# Altium schematic sheet MCU.SchDoc
size A3
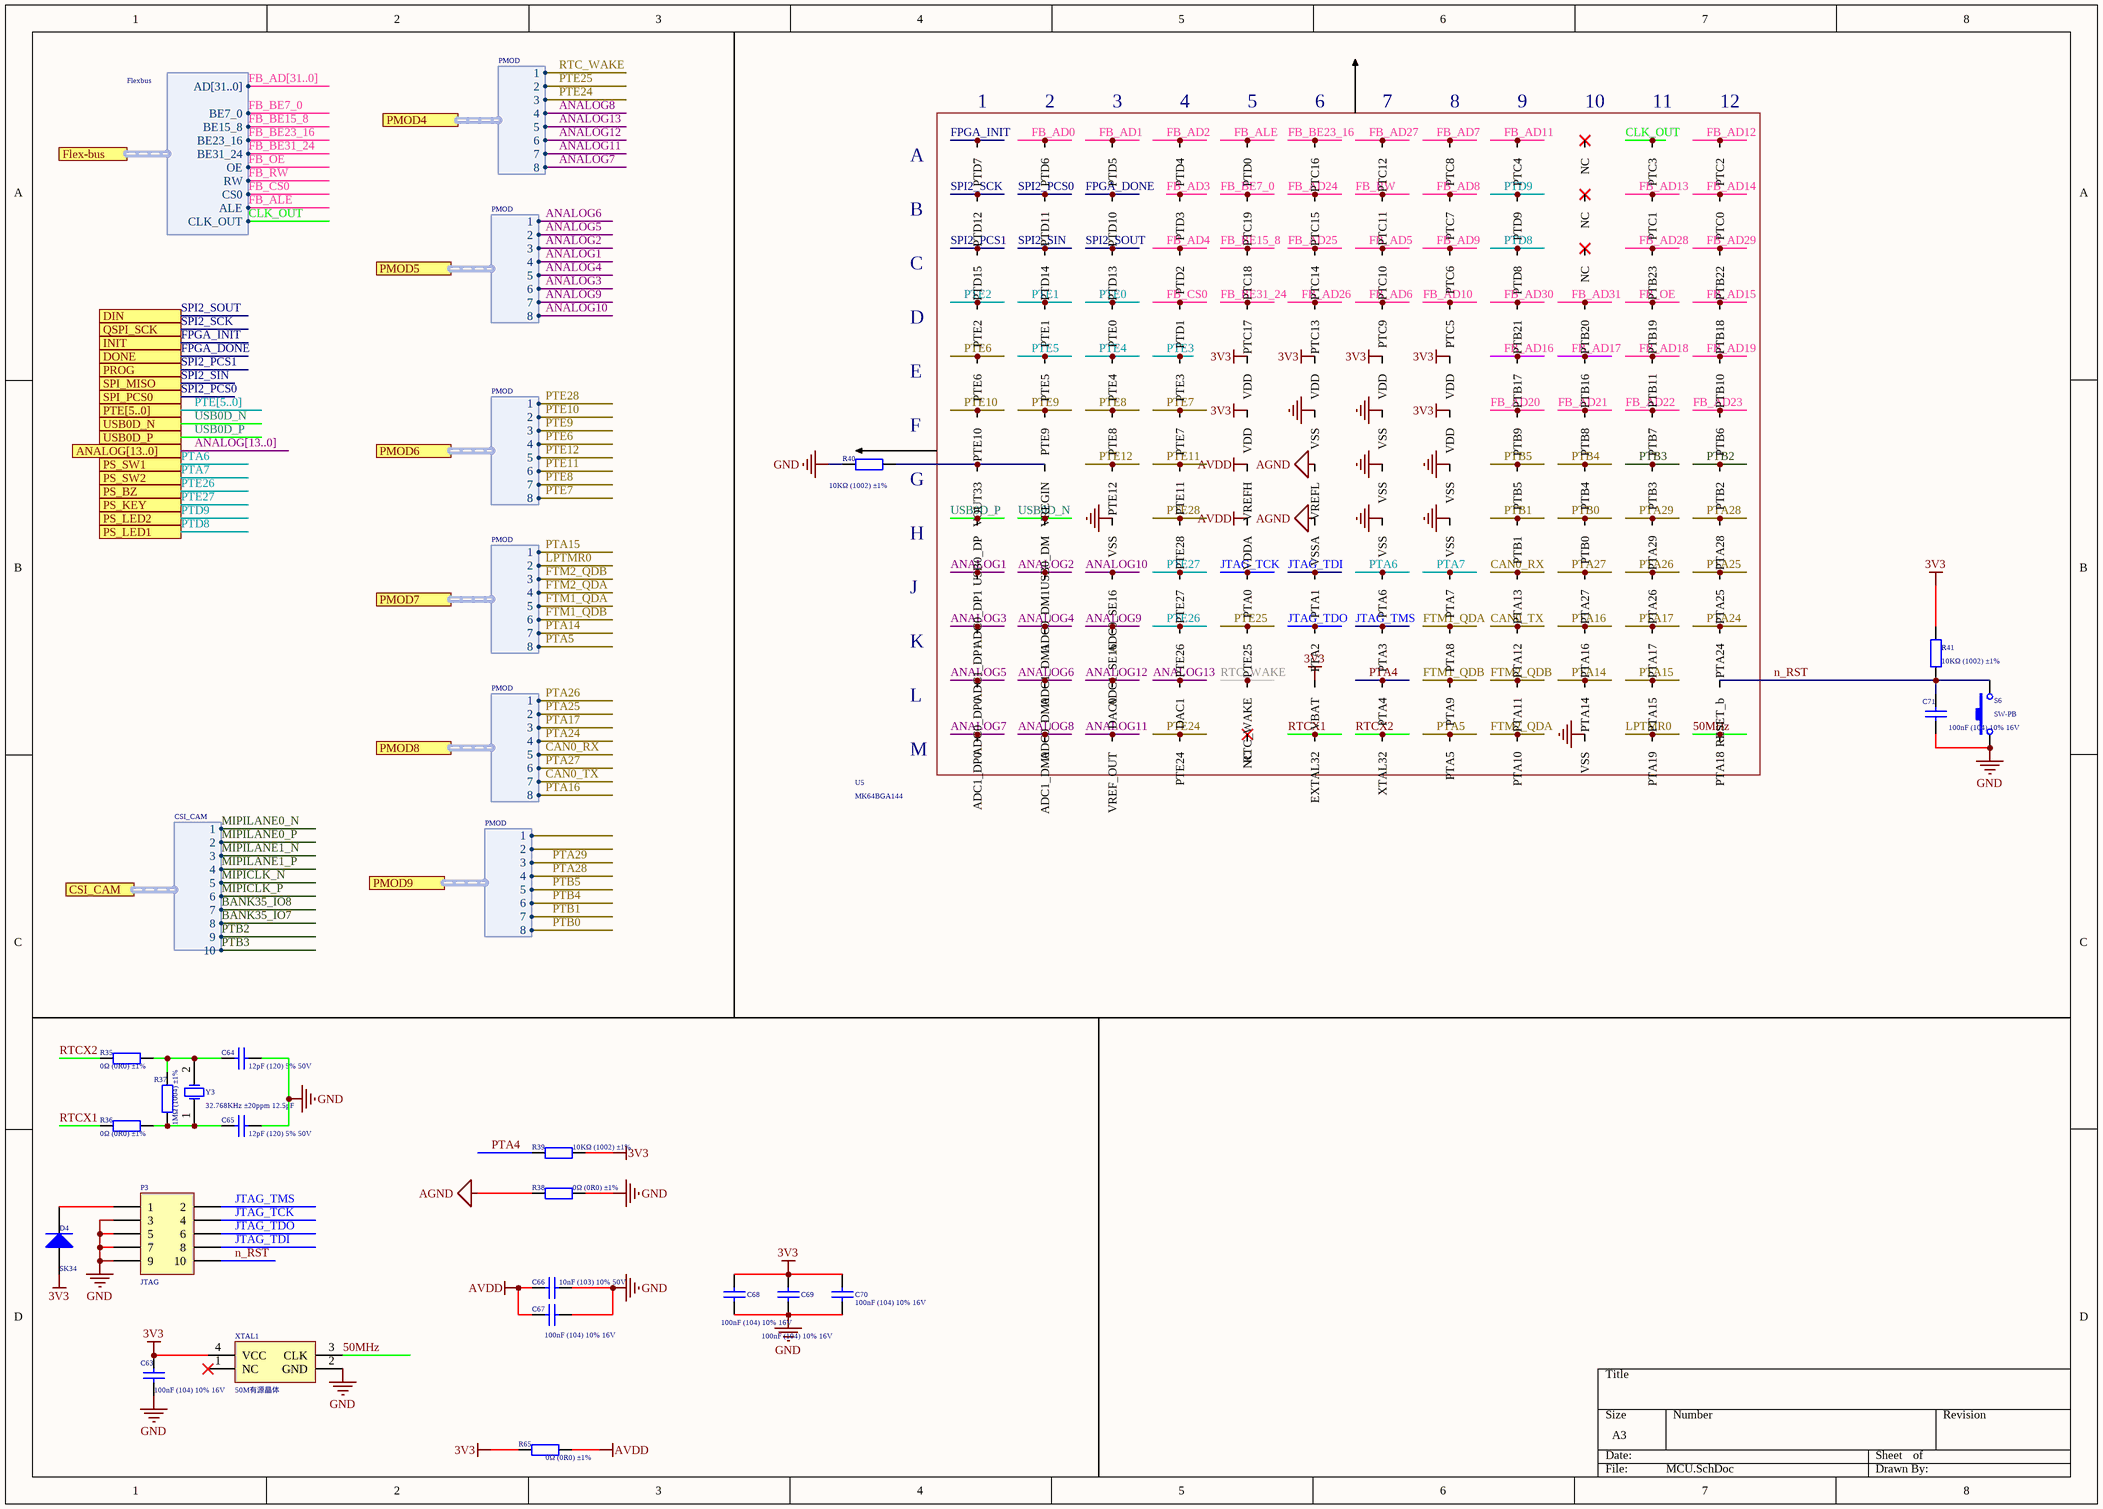
[diagram p0: MCU.SchDoc]

## Parts
C63  100nF (104) 10% 16V  [0402_C]
C64  12pF (120) 5% 50V  [0402_C]
C65  12pF (120) 5% 50V  [0402_C]
C66  10nF (103) 10% 50V  [0402_C]
C67  100nF (104) 10% 16V  [0402_C]
C68  100nF (104) 10% 16V  [0402_C]
C69  100nF (104) 10% 16V  [0402_C]
C70  100nF (104) 10% 16V  [0402_C]
C71  100nF (104) 10% 16V  [0402_C]
D4  SK34  [C2012]
P3  JTAG  [HDR2X5]
R35  0Ω (0R0) ±1%  [0402_R]
R36  0Ω (0R0) ±1%  [0402_R]
R37  1MΩ (1004) ±1%  [0402_R]
R38  0Ω (0R0) ±1%  [0402_R]
R39  10KΩ (1002) ±1%  [0402_R]
R40  10KΩ (1002) ±1%  [0402_R]
R41  10KΩ (1002) ±1%  [0402_R]
R65  0Ω (0R0) ±1%  [0402_R]
S6  SW-PB  [key 3*4*2]
U5  MK64BGA144  [BGA144C100P12X12_1300X1300X161]
XTAL1  50M有源晶体  [XTAL7_3225]
Y3  32.768KHz ±20ppm 12.5pF  [SMD-3215_2P FC - 135]

## Ports
ANALOG[13..0] (harness Flexbus), CSI_CAM (harness CSI_CAM), DIN, DONE, Flex-bus (harness Flexbus), INIT, PMOD4 (harness PMOD), PMOD5 (harness PMOD), PMOD6 (harness PMOD), PMOD7 (harness PMOD), PMOD8 (harness PMOD), PMOD9 (harness PMOD), PROG, PS_BZ, PS_KEY, PS_LED1, PS_LED2, PS_SW1, PS_SW2, PTE[5..0], QSPI_SCK, SPI_MISO, SPI_PCS0, USB0D_N, USB0D_P

## Harnesses
Flexbus: BE7_0, CS0, BE31_24, CLK_OUT, ALE, BE23_16, RW, BE15_8, OE, AD[31..0]
PMOD: 1, 2, 3, 4, 5, 6, 7, 8
CSI_CAM: 1, 2, 3, 4, 5, 6, 7, 8, 9, 10

## Nets
3V3: C63.2 C68.2 C69.2 C70.2 D4.1(A) R39.2 R41.2 R65.1 U5.E5(VDD) U5.E6(VDD) U5.E7(VDD) U5.E8(VDD) U5.F5(VDD) U5.F8(VDD) U5.L6(VBAT) XTAL1.4(VCC)
AGND: R38.1 U5.G6(VREFL) U5.H6(VSSA)
AVDD: C66.1 C67.1 R65.2 U5.G5(VREFH) U5.H5(VDDA)
GND: C63.1 C64.2 C65.2 C66.2 C67.2 C68.1 C69.1 C70.1 C71.1 P3.3 P3.5 P3.7 P3.9 R38.2 R40.1 S6.1 U5.F6(VSS) U5.F7(VSS) U5.G7(VSS) U5.G8(VSS) U5.H3(VSS) U5.H7(VSS) U5.H8(VSS) U5.M10(VSS) XTAL1.2(GND)
50MHz: U5.M12(PTA18) XTAL1.3(CLK)
ANALOG1: U5.J1(ADC0_DP1) ; port PMOD5.4
ANALOG2: U5.J2(ADC0_DM1) ; port PMOD5.3
ANALOG3: U5.K1(ADC1_DP1) ; port PMOD5.6
ANALOG4: U5.K2(ADC1_DM1) ; port PMOD5.5
ANALOG5: U5.L1(ADC0_DP0) ; port PMOD5.2
ANALOG6: U5.L2(ADC0_DM0) ; port PMOD5.1
ANALOG7: U5.M1(ADC1_DP0) ; port PMOD4.8
ANALOG8: U5.M2(ADC1_DM0) ; port PMOD4.4
ANALOG9: U5.K3(ADC1_SE16) ; port PMOD5.7
ANALOG10: U5.J3(ADC0_SE16) ; port PMOD5.8
ANALOG11: U5.M3(VREF_OUT) ; port PMOD4.7
ANALOG12: U5.L3(DAC0) ; port PMOD4.6
ANALOG13: U5.L4(DAC1) ; port PMOD4.5
BANK35_IO7: port CSI_CAM.8
BANK35_IO8: port CSI_CAM.7
CAN0_RX: U5.J9(PTA13) ; port PMOD8.5
CAN0_TX: U5.K9(PTA12) ; port PMOD8.7
CLK_OUT: U5.A11(PTC3) ; port Flex-bus.CLK_OUT
FB_AD0: U5.A2(PTD6)
FB_AD1: U5.A3(PTD5)
FB_AD2: U5.A4(PTD4)
FB_AD3: U5.B4(PTD3)
FB_AD4: U5.C4(PTD2)
FB_AD5: U5.C7(PTC10)
FB_AD6: U5.D7(PTC9)
FB_AD7: U5.A8(PTC8)
FB_AD8: U5.B8(PTC7)
FB_AD9: U5.C8(PTC6)
FB_AD10: U5.D8(PTC5)
FB_AD11: U5.A9(PTC4)
FB_AD12: U5.A12(PTC2)
FB_AD13: U5.B11(PTC1)
FB_AD14: U5.B12(PTC0)
FB_AD15: U5.D12(PTB18)
FB_AD16: U5.E9(PTB17)
FB_AD17: U5.E10(PTB16)
FB_AD18: U5.E11(PTB11)
FB_AD19: U5.E12(PTB10)
FB_AD20: U5.F9(PTB9)
FB_AD21: U5.F10(PTB8)
FB_AD22: U5.F11(PTB7)
FB_AD23: U5.F12(PTB6)
FB_AD24: U5.B6(PTC15)
FB_AD25: U5.C6(PTC14)
FB_AD26: U5.D6(PTC13)
FB_AD27: U5.A7(PTC12)
FB_AD28: U5.C11(PTB23)
FB_AD29: U5.C12(PTB22)
FB_AD30: U5.D9(PTB21)
FB_AD31: U5.D10(PTB20)
FB_ALE: U5.A5(PTD0) ; port Flex-bus.ALE
FB_BE7_0: U5.B5(PTC19) ; port Flex-bus.BE7_0
FB_BE15_8: U5.C5(PTC18) ; port Flex-bus.BE15_8
FB_BE23_16: U5.A6(PTC16) ; port Flex-bus.BE23_16
FB_BE31_24: U5.D5(PTC17) ; port Flex-bus.BE31_24
FB_CS0: U5.D4(PTD1) ; port Flex-bus.CS0
FB_OE: U5.D11(PTB19) ; port Flex-bus.OE
FB_RW: U5.B7(PTC11) ; port Flex-bus.RW
FPGA_DONE: U5.B3(PTD10) ; port DONE
FPGA_INIT: U5.A1(PTD7) ; port INIT
FTM1_QDA: U5.K8(PTA8) ; port PMOD7.5
FTM1_QDB: U5.L8(PTA9) ; port PMOD7.6
FTM2_QDA: U5.M9(PTA10) ; port PMOD7.4
FTM2_QDB: U5.L9(PTA11) ; port PMOD7.3
JTAG_TCK: P3.4 U5.J5(PTA0)
JTAG_TDI: P3.8 U5.J6(PTA1)
JTAG_TDO: P3.6 U5.K6(PTA2)
JTAG_TMS: P3.2 U5.K7(PTA3)
LPTMR0: U5.M11(PTA19) ; port PMOD7.2
MIPICLK_N: port CSI_CAM.5
MIPICLK_P: port CSI_CAM.6
MIPILANE0_N: port CSI_CAM.1
MIPILANE0_P: port CSI_CAM.2
MIPILANE1_N: port CSI_CAM.3
MIPILANE1_P: port CSI_CAM.4
n_RST: C71.2 P3.10 R41.1 S6.2 U5.L12(RESET_b)
PTA4: R39.1 U5.L7(PTA4)
PTA5: U5.M8(PTA5) ; port PMOD7.8
PTA6: U5.J7(PTA6) ; port PS_SW1
PTA7: U5.J8(PTA7) ; port PS_SW2
PTA14: U5.L10(PTA14) ; port PMOD7.7
PTA15: U5.L11(PTA15) ; port PMOD7.1
PTA16: U5.K10(PTA16) ; port PMOD8.8
PTA17: U5.K11(PTA17) ; port PMOD8.3
PTA24: U5.K12(PTA24) ; port PMOD8.4
PTA25: U5.J12(PTA25) ; port PMOD8.2
PTA26: U5.J11(PTA26) ; port PMOD8.1
PTA27: U5.J10(PTA27) ; port PMOD8.6
PTA28: U5.H12(PTA28) ; port PMOD9.4
PTA29: U5.H11(PTA29) ; port PMOD9.3
PTB0: U5.H10(PTB0) ; port PMOD9.8
PTB1: U5.H9(PTB1) ; port PMOD9.7
PTB2: U5.G12(PTB2) ; port CSI_CAM.9
PTB3: U5.G11(PTB3) ; port CSI_CAM.10
PTB4: U5.G10(PTB4) ; port PMOD9.6
PTB5: U5.G9(PTB5) ; port PMOD9.5
PTD8: U5.C9(PTD8) ; port PS_LED1
PTD9: U5.B9(PTD9) ; port PS_LED2
PTE0: U5.D3(PTE0)
PTE1: U5.D2(PTE1)
PTE2: U5.D1(PTE2)
PTE3: U5.E4(PTE3)
PTE4: U5.E3(PTE4)
PTE5: U5.E2(PTE5)
PTE6: U5.E1(PTE6) ; port PMOD6.4
PTE7: U5.F4(PTE7) ; port PMOD6.8
PTE8: U5.F3(PTE8) ; port PMOD6.7
PTE9: U5.F2(PTE9) ; port PMOD6.3
PTE10: U5.F1(PTE10) ; port PMOD6.2
PTE11: U5.G4(PTE11) ; port PMOD6.6
PTE12: U5.G3(PTE12) ; port PMOD6.5
PTE24: U5.M4(PTE24) ; port PMOD4.3
PTE25: U5.K5(PTE25) ; port PMOD4.2
PTE26: U5.K4(PTE26) ; port PS_BZ
PTE27: U5.J4(PTE27) ; port PS_KEY
PTE28: U5.H4(PTE28) ; port PMOD6.1
RTC_WAKE: U5.L5(RTC_WAKE) ; port PMOD4.1
RTCX1: R36.1 U5.M6(EXTAL32)
RTCX2: R35.1 U5.M7(XTAL32)
SPI2_PCS0: U5.B2(PTD11) ; port SPI_PCS0
SPI2_PCS1: U5.C1(PTD15) ; port PROG
SPI2_SCK: U5.B1(PTD12) ; port QSPI_SCK
SPI2_SIN: U5.C2(PTD14) ; port SPI_MISO
SPI2_SOUT: U5.C3(PTD13) ; port DIN
USB0D_N: U5.H2(USB0_DM) ; port USB0D_N
USB0D_P: U5.H1(USB0_DP) ; port USB0D_P
NetC64_1: C64.1 R35.2 R37.2 Y3.2(OSC2)
NetC65_1: C65.1 R36.2 R37.1 Y3.1(OSC1)
NetD4_2: D4.2(K) P3.1
NetR40_2: R40.2 U5.G1(VOUT33) U5.G2(VREGIN)

Not connected (* = marked no-connect by the designer): U5 A10(NC)* B10(NC)* C10(NC)* M5(NC)*; XTAL1 1(NC)*

## Buses and harness runs
bus ANALOG[13..0]
bus FB_AD[31..0]
bus PTE[5..0] = port PTE[5..0]

## Notes on the sheet
- (in symbol MK64BGA144) 1; 2; 3; 4; 5; 6; 7; 8; 9; 10; 11; 12; A; B; C; D; E; F; G; H; J; K; L; M

## Library data of the parts
C63 C67-C71 = 0402 100nF (104) 10% 16V: 贴片电容; ComponentLink1Description: 供应商链接; ComponentLink1URL: http://www.szlcsc.com/product/details_1877.html; Package: 0402; Supplier: LC; SuppliersPartNumber: C1525
C64 C65 = 0402 12pF (120) 5% 50V: 贴片电容; ComponentLink1Description: 供应商链接; ComponentLink1URL: http://www.szlcsc.com/product/details_1899.html; Package: 0402; Supplier: LC; SuppliersPartNumber: C1547
C66 = 0402 10nF (103) 10% 50V: 贴片电容; ComponentLink1Description: 供应商链接; ComponentLink1URL: http://www.szlcsc.com/product/details_15869.html; Package: 0402; Supplier: LC; SuppliersPartNumber: C15195
D4 = Diode 1N4148: High Conductance Fast Diode; LatestRevisionDate: 17-Jul-2002; LatestRevisionNote: Re-released for DXP Platform.; DatasheetDocument: 1997; PackageReference: DO-35; Publisher: Altium Limited; Code_JEDEC: DO-204-AH; ComponentLink1Description: Manufacturer Link; ComponentLink2Description: Datasheet; ComponentLink2URL: http://www.fairchildsemi.com/ds/1N%2F1N4148.pdf
P3 = Header 5X2: Header, 5-Pin, Dual row; LatestRevisionDate: 17-Jul-2002; LatestRevisionNote: Re-released for DXP Platform.; Publisher: Altium Limited
R35 R36 R38 R65 = 0402 0Ω (0R0) 1%: 贴片电阻; ComponentLink1Description: 供应商链接; ComponentLink1URL: http://www.szlcsc.com/product/details_17853.html; Package: 0402; Supplier: LC; SuppliersPartNumber: C17168
R37 = 0402 1MΩ (1004) 1%: 贴片电阻; ComponentLink1Description: 供应商链接; ComponentLink1URL: http://www.szlcsc.com/product/details_26826.html; Package: 0402; Supplier: LC; SuppliersPartNumber: C26083
R39-R41 = 0402 10KΩ (1002) 1%: 贴片电阻; ComponentLink1Description: 供应商链接; ComponentLink1URL: http://www.szlcsc.com/product/details_26487.html; Package: 0402; Supplier: LC; SuppliersPartNumber: C25744
S6 = SW-PB: Switch
XTAL1 = 有源晶体
Y3 = SMD-3215_2P 32.768KHz 20ppm 12.5pF: 贴片晶振; ComponentLink1Description: 供应商链接; ComponentLink1URL: http://www.szlcsc.com/product/details_33310.html; Package: SMD-3215_2P; Supplier: LC; SuppliersPartNumber: C32346